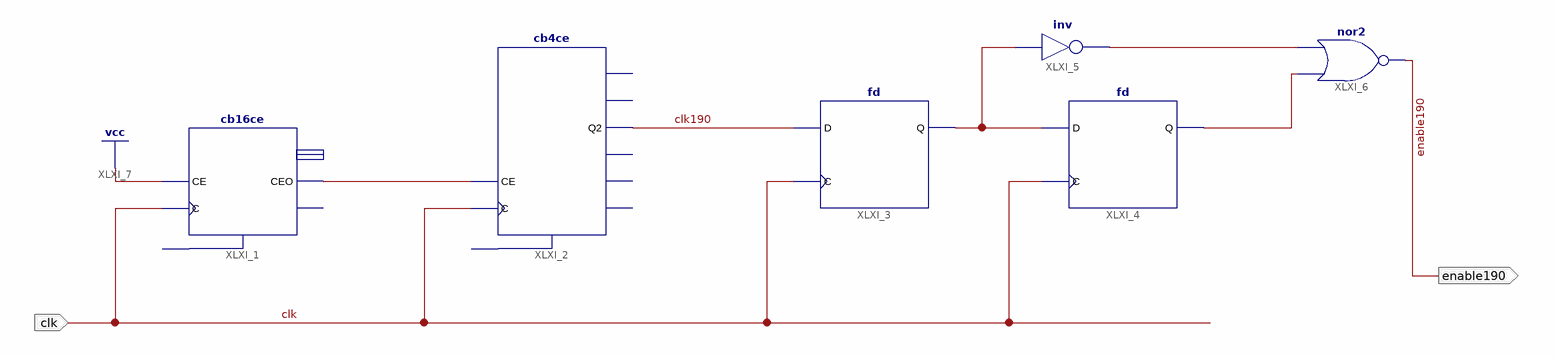
[diagram p0: schematic sheet 1]
// Xilinx ISE schematic Enable190.sch (spartan6) as structural Verilog: 6 symbols, 2 ports
module Enable190 (
  input  clk,
  output enable190
);

  wire clk190, XLXN_7, XLXN_10, XLXN_11, XLXN_12;

  cb16ce XLXI_1 (.C(clk), .CE(1'b1), .CEO(XLXN_7));  // open: CLR, Q, TC
  fd XLXI_3 (.C(clk), .D(clk190), .Q(XLXN_10));
  fd XLXI_4 (.C(clk), .D(XLXN_10), .Q(XLXN_12));
  cb4ce XLXI_2 (.C(clk), .CE(XLXN_7), .Q2(clk190));  // open: CLR, CEO, Q0, Q1, Q3, TC
  nor XLXI_6 (enable190, XLXN_12, XLXN_11);
  not XLXI_5 (XLXN_11, XLXN_10);
endmodule
